# Altium schematic sheet Laser_Tec_Control.SchDoc
size A4; SheetNumber: 3; SheetTotal: 4
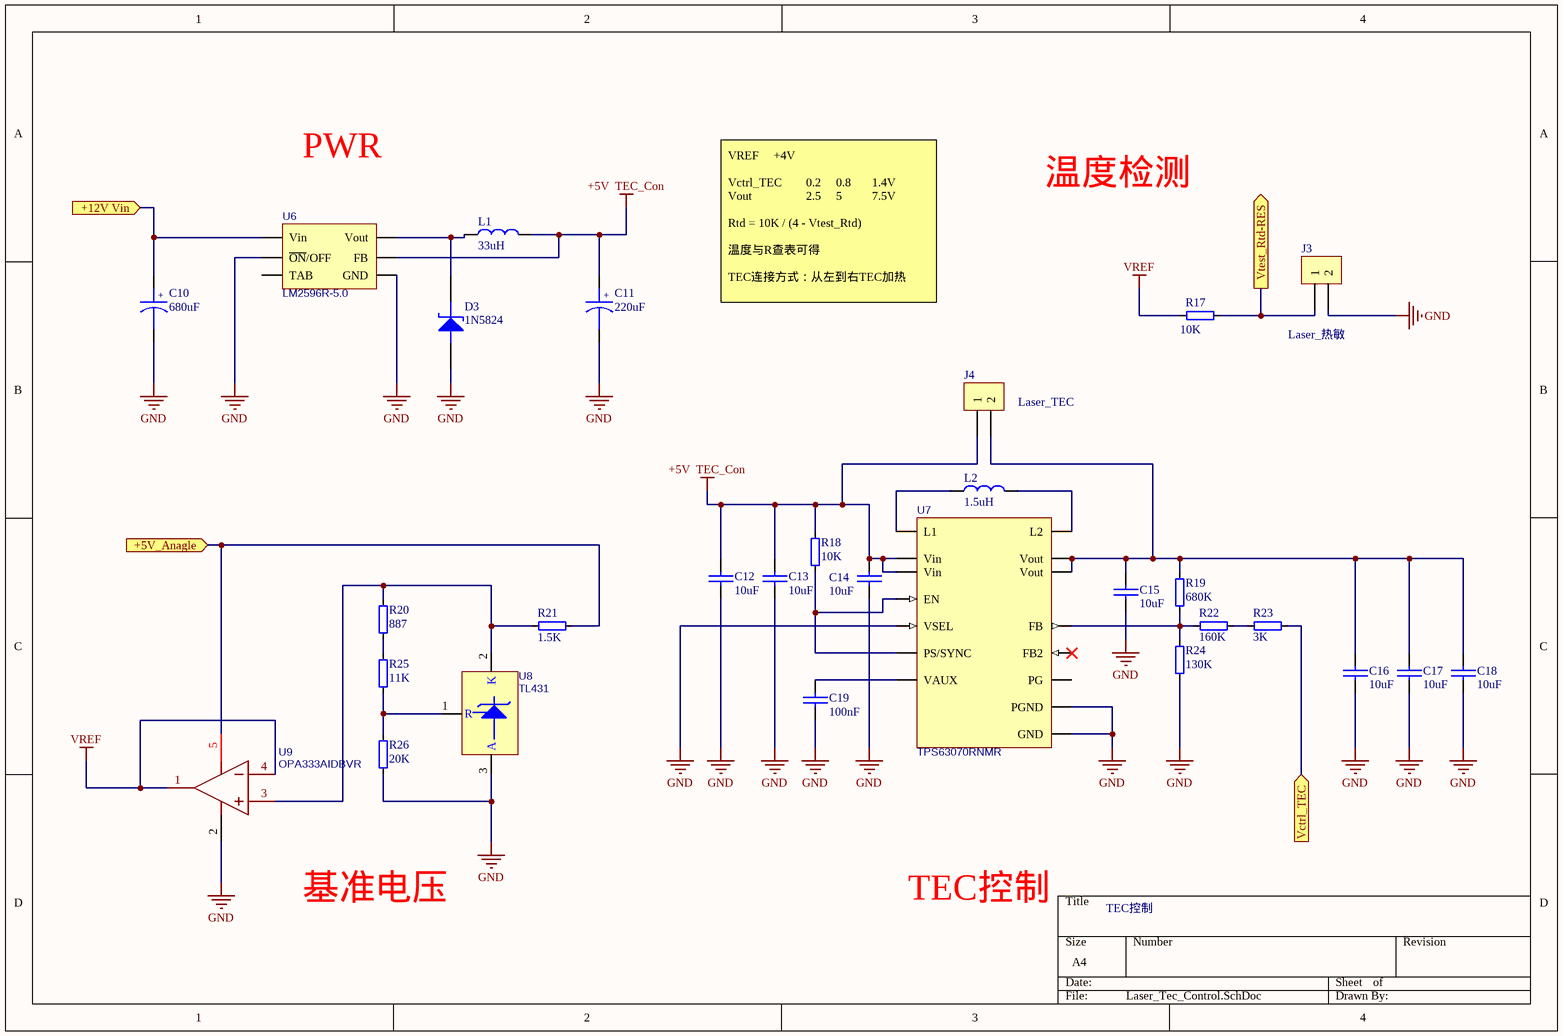
[diagram p0: Laser_Tec_Control.SchDoc]

## Parts
C10  680uF  [CAP-TH_BD8.0-P3.50-D0.6-FD]
C11  220uF  [CAP-TH_BD8.0-P3.50-D0.6-FD]
C12  10uF  [C 0805_M]
C13  10uF  [C 0805_M]
C14  10uF  [C 0805_M]
C15  10uF  [C 0805_M]
C16  10uF  [C 0805_M]
C17  10uF  [C 0805_M]
C18  10uF  [C 0805_M]
C19  100nF  [C 0805_M]
D3  1N5824  [SMA_L4.3-W2.6-LS5.0-RD]
J3  Laser_热敏  [KF128-5.08-2P]
J4  Laser_TEC  [KF128-5.08-2P]
L1  33uH  [L 0805]
L2  1.5uH  [L 0805]
R17  10K  [0805R]
R18  10K  [0805R]
R19  680K  [0805R]
R20  887  [0805R]
R21  1.5K  [0805R]
R22  160K  [0805R]
R23  3K  [0805R]
R24  130K  [0805R]
R25  11K  [0805R]
R26  20K  [0805R]
U6  LM2596R-5.0  [TO-263-5_L10.2-W8.6-P1.70-LS14.4-TL]
U7  TPS63070RNMR  [VQFN-HR-15_L3.0-W2.5-P0.50-BL_TPS63070RNMR]
U8  TL431  [SOT-23-3_L2.9-W1.4-P1.90-LS2.6-BR]
U9  OPA333AIDBVR  [SOT-23-5_L3.0-W1.7-P0.95-LS2.8-BR]

## Ports
+5V_Anagle (in), +12V Vin (in), Vctrl_TEC (in), Vtest_Rtd-RES (out)

## Nets
+5V  TEC_Con: C11.1 C12.1 C13.1 C14.1 J4.1 L1.1 R18.2 U6.4(FB) U7.12(Vin) U7.13(Vin)
GND: C10.2 C11.2 C12.2 C13.2 C14.2 C15.2 C16.2 C17.2 C18.2 C19.2 D3.1(A) J3.2 R24.1 R26.1 U6.3(GND) U6.5(~{ON}/OFF) U7.4(GND) U7.10(PGND) U7.15(VSEL) U8.3(A) U9.2(V-)
VREF: R17.1 U9.1(OUT) U9.4(IN-)
+5V_Anagle: R21.1 U9.5(V+) ; port +5V_Anagle
+12V Vin: C10.1 U6.1(Vin) ; port +12V Vin
Vctrl_TEC: R23.1 ; port Vctrl_TEC
Vtest_Rtd-RES: J3.1 R17.2 ; port Vtest_Rtd-RES
NetC15_1: C15.1 C16.1 C17.1 C18.1 J4.2 R19.2 U7.7(Vout) U7.8(Vout)
NetC19_1: C19.1 U7.3(VAUX)
NetD3_2: D3.2(K) L1.2 U6.2(Vout)
NetL2_1: L2.1 U7.9(L2)
NetL2_2: L2.2 U7.11(L1)
NetR18_1: R18.1 U7.1(PS/SYNC) U7.14(EN)
NetR19_1: R19.1 R22.2 R24.2 U7.5(FB)
NetR20_1: R20.1 R25.2
NetR20_2: R20.2 R21.2 U8.2(K) U9.3(IN+)
NetR22_1: R22.1 R23.2
NetR25_1: R25.1 R26.2 U8.1(R)

Not connected (* = marked no-connect by the designer): U6 6(TAB); U7 2(PG) 6(FB2)*

## Notes on the sheet
- PWR
- 温度检测
- VREF     +4V
  Vctrl_TEC        0.2     0.8       1.4V
  Vout                  2.5     5          7.5V
  Rtd = 10K / (4 - Vtest_Rtd)
  温度与R查表可得
  TEC连接方式：从左到右TEC加热
- 基准电压
- TEC控制
- (in symbol 电解电容1) +

## Library data of the parts
C10 C11 = 电解电容1: Capacitor
C12 C17 C18 = 普通电容: Capacitor 0805
C13 C16 = 普通电容: Capacitor,0805
C14 C15 = 普通电容: Capacitor,0603
C19 = 普通电容: Capacitor
D3 = 1N5824: Zener Diode
J3 J4 = SIP2: jointbar
L1 L2 = L1: 电感
R17-R26 = 普通电阻
U6 = LM2596R-5.0: BOM_Manufacturer: HTC; BOM_Supplier: LCSC; BOM_Manufacturer Part: LM2596R-5.0; BOM_Supplier Part: C77782; BOM_JLCPCB Part Class: Extended Part; spicePre: U; spiceSymbolName: LM2596R-5.0
U7 = TPS63070RNMR: BOM_Manufacturer: TI; BOM_Supplier: LCSC; BOM_Manufacturer Part: TPS63070RNMR; BOM_Supplier Part: C109322; BOM_JLCPCB Part Class: Extended Part; spicePre: U; spiceSymbolName: TPS63070RNMR
U8 = TL431: BOM_Manufacturer: JSMSEMI; Contributor: LCSC; BOM_Supplier: LCSC; BOM_Supplier Part: C963380; BOM_Manufacturer Part: TL431; BOM_JLCPCB Part Class: Extended Part; spicePre: U; spiceSymbolName: TL431_C963380
U9 = OPA333AIDBVR: BOM_Manufacturer: TI; Contributor: LCSC; BOM_Supplier: LCSC; BOM_Manufacturer Part: OPA333AIDBVR; BOM_Supplier Part: C30878; BOM_JLCPCB Part Class: Extended Part; spicePre: U; spiceSymbolName: OPA333AIDBVR